# EAGLE schematic newConnectESP (EAGLE 9.5.2)
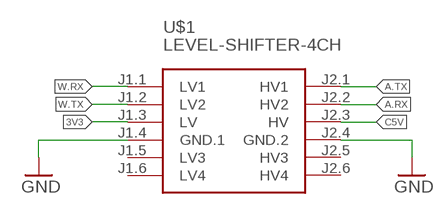
[diagram p0: schematic, sheet 1]

## Parts
U$1  LEVEL-SHIFTER-4CH  [LEVEL-SHIFTER-4CH]

## Nets
3V3: U$1.J1.3(LV)
A.RX: U$1.J2.2(HV2)
A.TX: U$1.J2.1(HV1)
C5V: U$1.J2.3(HV)
GND: U$1.J1.4(GND.1) U$1.J2.4(GND.2)
W.RX: U$1.J1.1(LV1)
W.TX: U$1.J1.2(LV2)
Unconnected: U$1.J1.5(LV3) U$1.J1.6(LV4) U$1.J2.5(HV3) U$1.J2.6(HV4)

## Library data of the parts
U$1 = diy-modules:LEVEL-SHIFTER-4CH: 4-Channel Bi-Directional Logic Level Converter based on BSS128 transistors Click here to find device on ebay.com <http://www.ebay.com/sch/i2c+logic+converter+module>